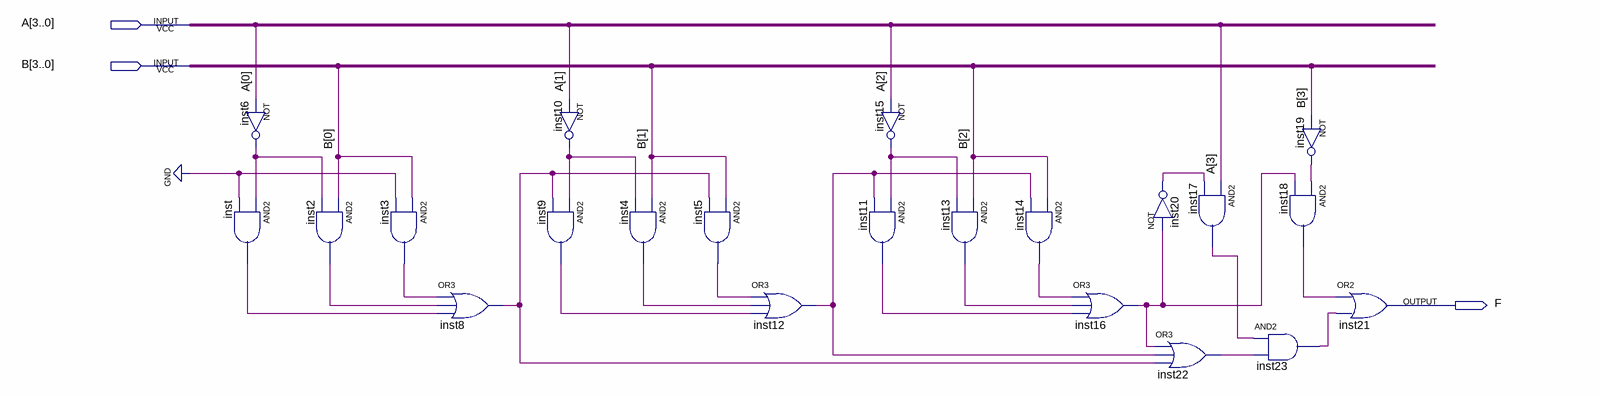
[diagram p0: schematic sheet]
// Quartus schematic MenorQue.bdf as structural Verilog: 22 symbols, 3 pins
module MenorQue (
  input  [3:0] A,
  input  [3:0] B,
  output F
);

  wire inst2_out, inst3_out, inst4_out, inst5_out, inst6_out, inst8_out, inst9_out, inst10_out, inst11_out,
       inst12_out, inst13_out, inst14_out, inst15_out, inst16_out, inst17_out, inst18_out, inst19_out,
       inst20_out, inst22_out, inst23_out, inst_out;

  not inst6 (inst6_out, A[0]);
  and inst (inst_out, inst6_out, 1'b0);
  and inst2 (inst2_out, B[0], inst6_out);
  and inst3 (inst3_out, B[0], 1'b0);
  or inst8 (inst8_out, inst3_out, inst2_out, inst_out);
  not inst10 (inst10_out, A[1]);
  and inst9 (inst9_out, inst10_out, inst8_out);
  and inst4 (inst4_out, B[1], inst10_out);
  and inst5 (inst5_out, B[1], inst8_out);
  or inst12 (inst12_out, inst5_out, inst4_out, inst9_out);
  not inst15 (inst15_out, A[2]);
  and inst11 (inst11_out, inst15_out, inst12_out);
  and inst13 (inst13_out, B[2], inst15_out);
  and inst14 (inst14_out, B[2], inst12_out);
  or inst16 (inst16_out, inst14_out, inst13_out, inst11_out);
  not inst20 (inst20_out, inst16_out);
  or inst22 (inst22_out, inst16_out, inst12_out, inst8_out);
  and inst17 (inst17_out, A[3], inst20_out);
  not inst19 (inst19_out, B[3]);
  and inst18 (inst18_out, inst19_out, inst16_out);
  and inst23 (inst23_out, inst17_out, inst22_out);
  or inst21 (F, inst18_out, inst23_out);
endmodule
